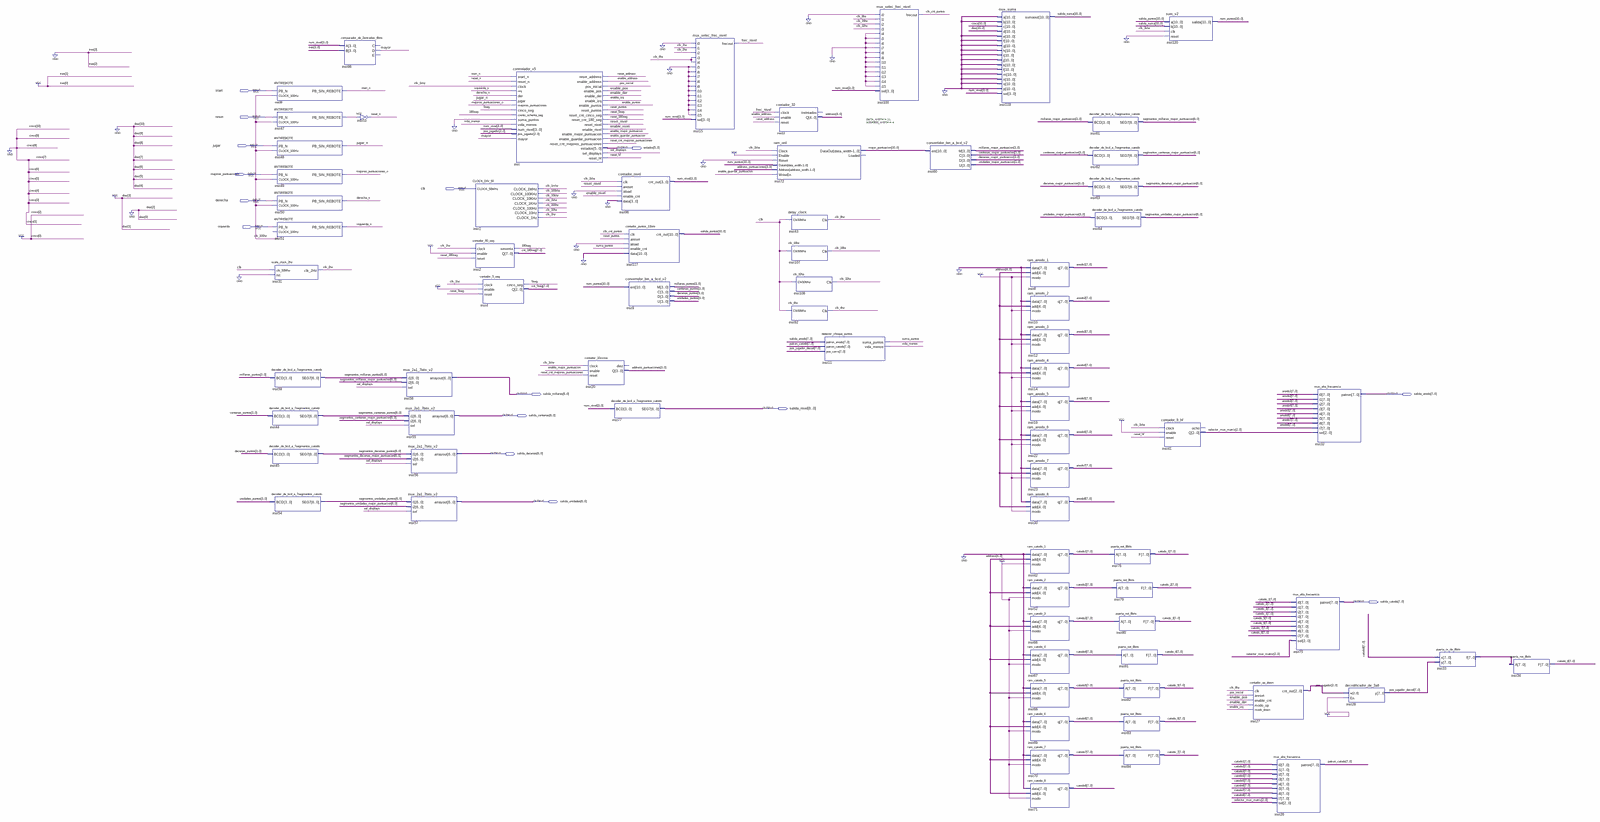
[diagram p0: schematic sheet, whole]
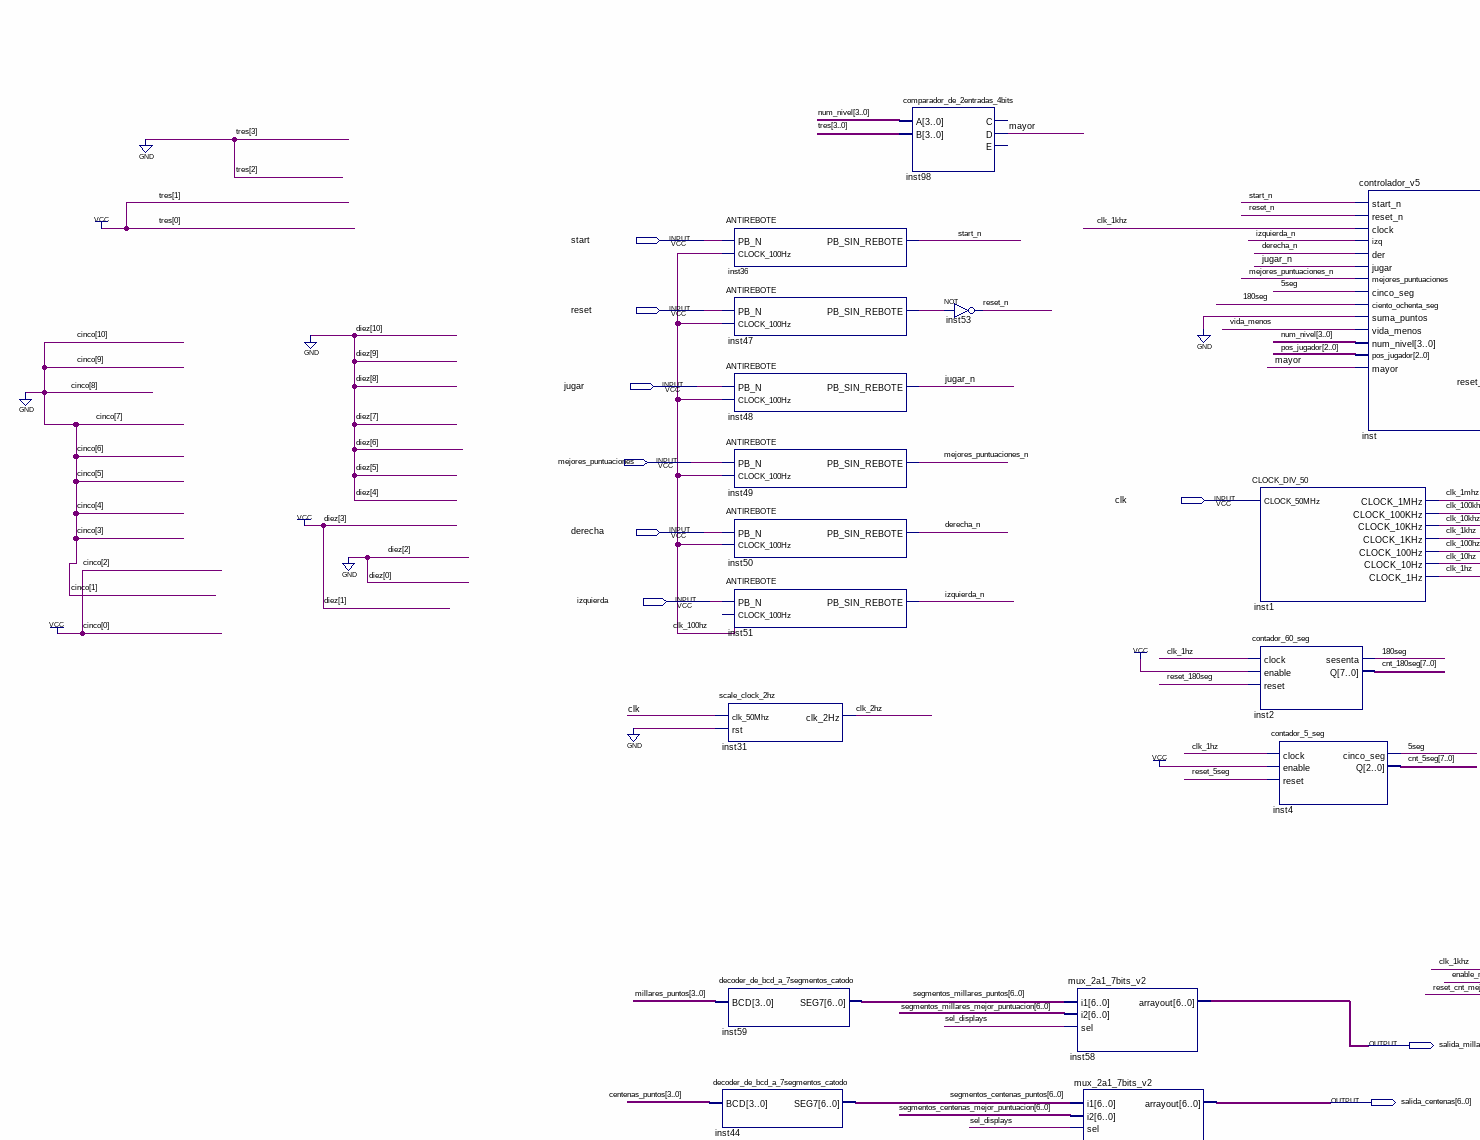
[diagram p1: schematic sheet, upper left part]
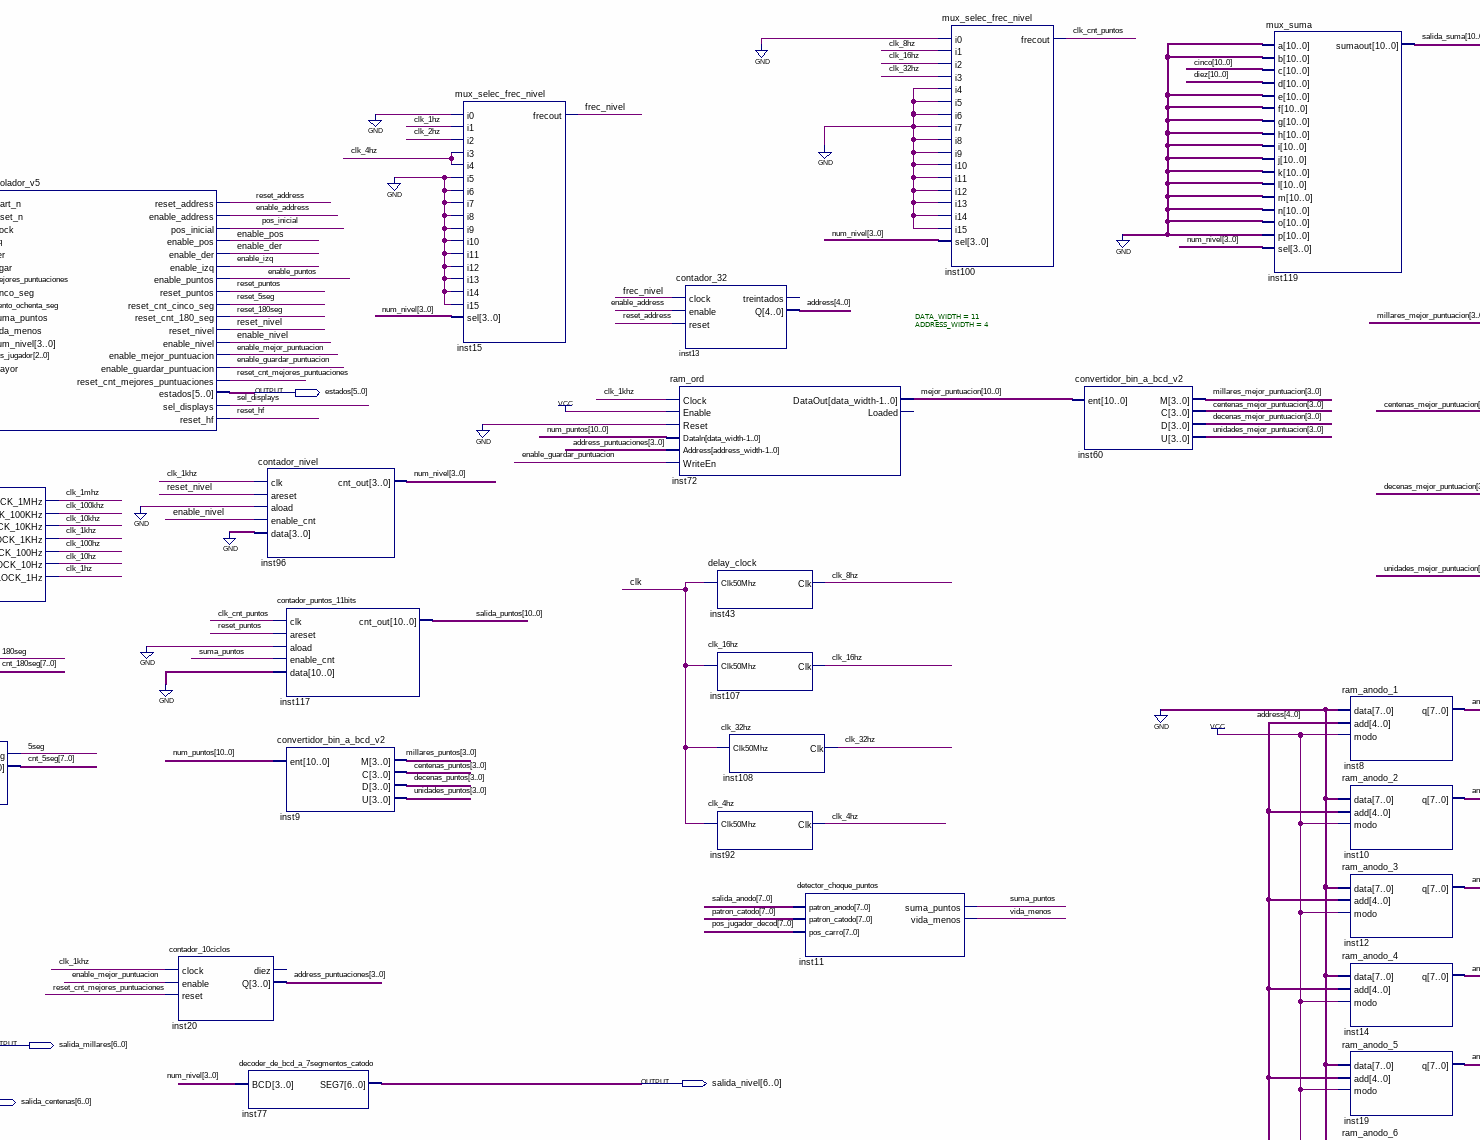
[diagram p2: schematic sheet, upper centre part]
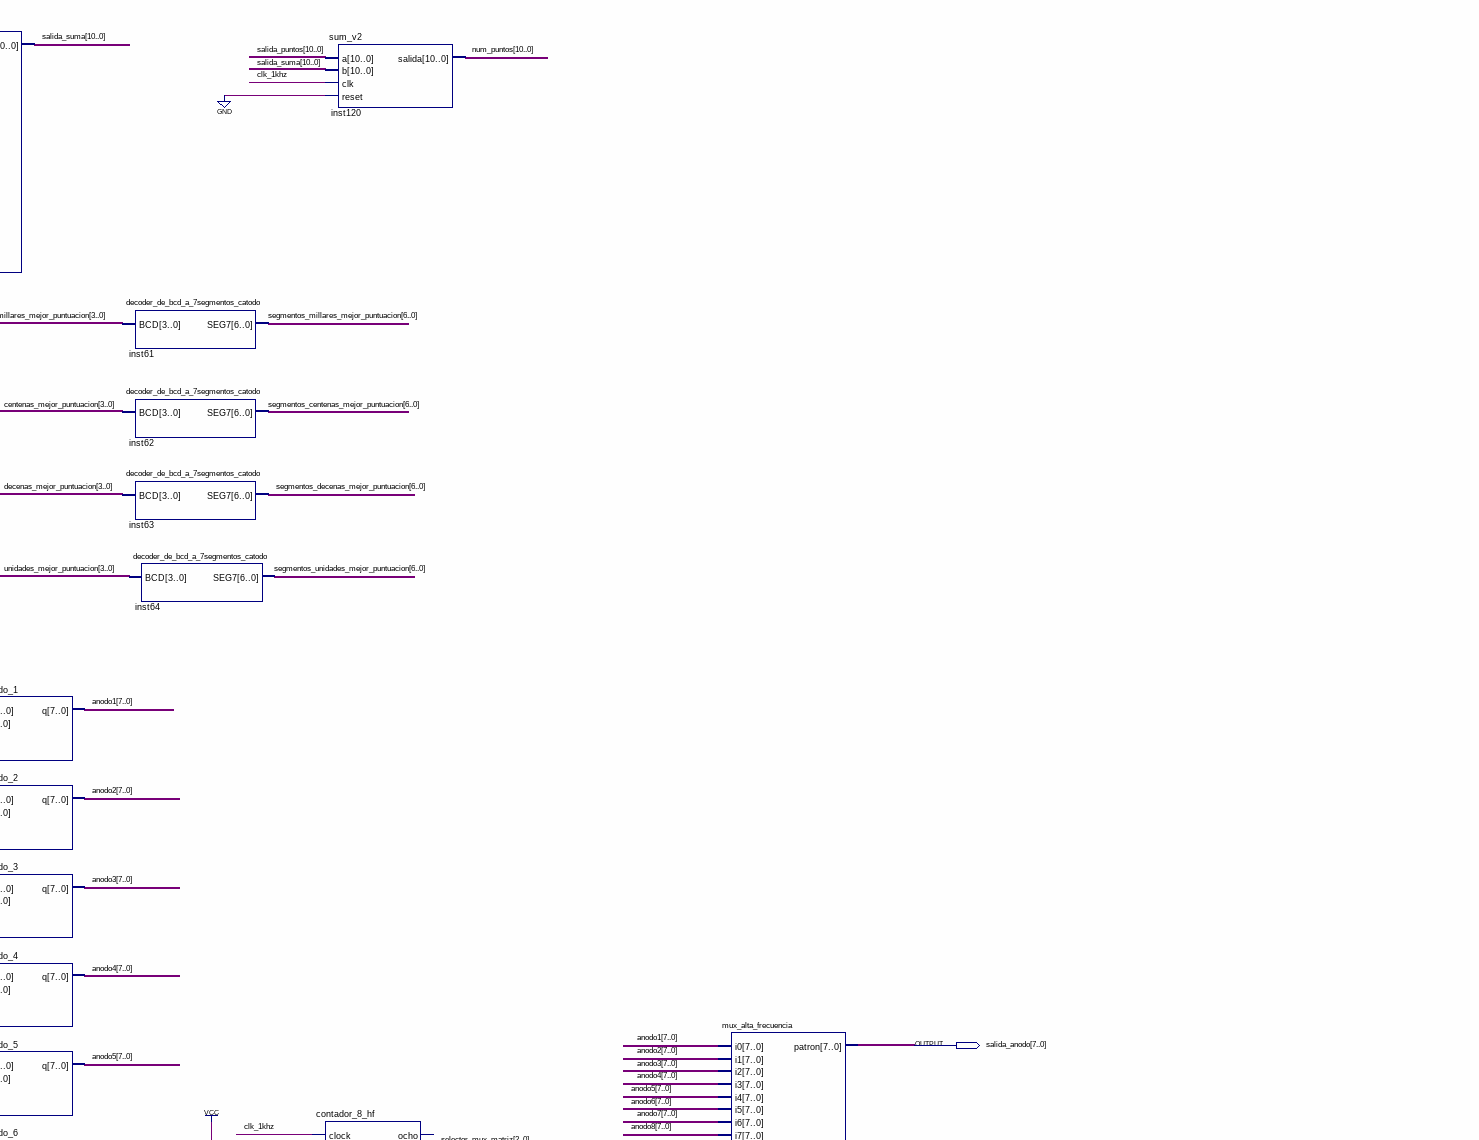
[diagram p3: schematic sheet, upper right part]
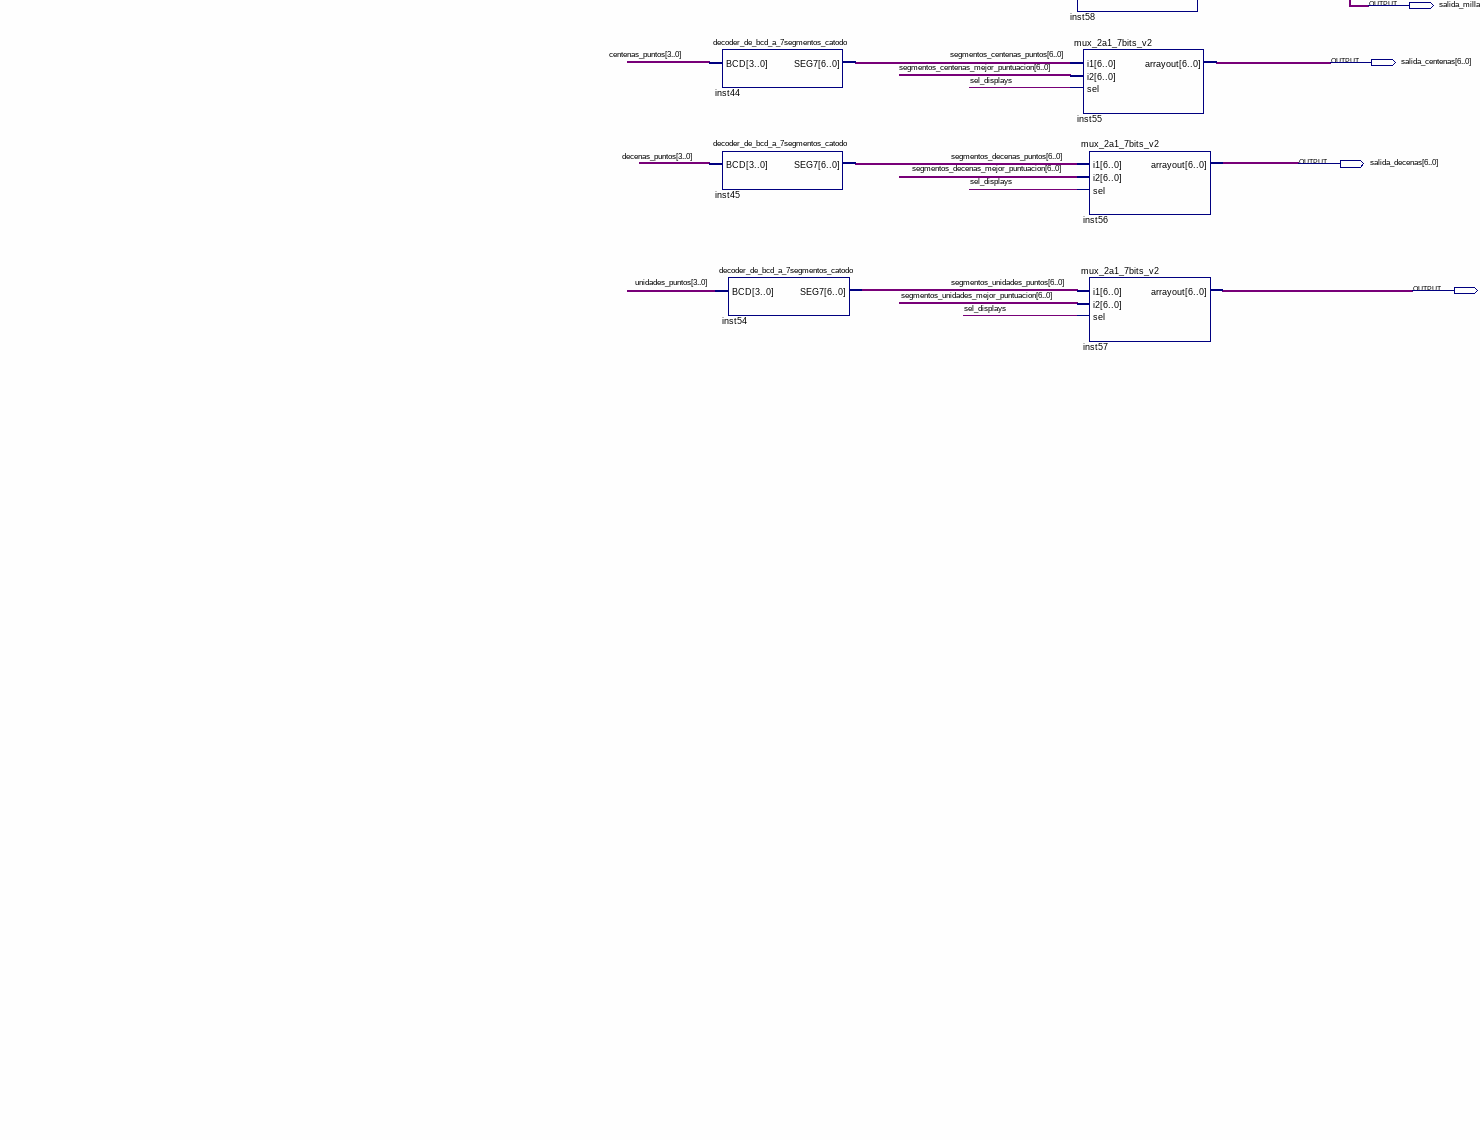
[diagram p4: schematic sheet, lower left part]
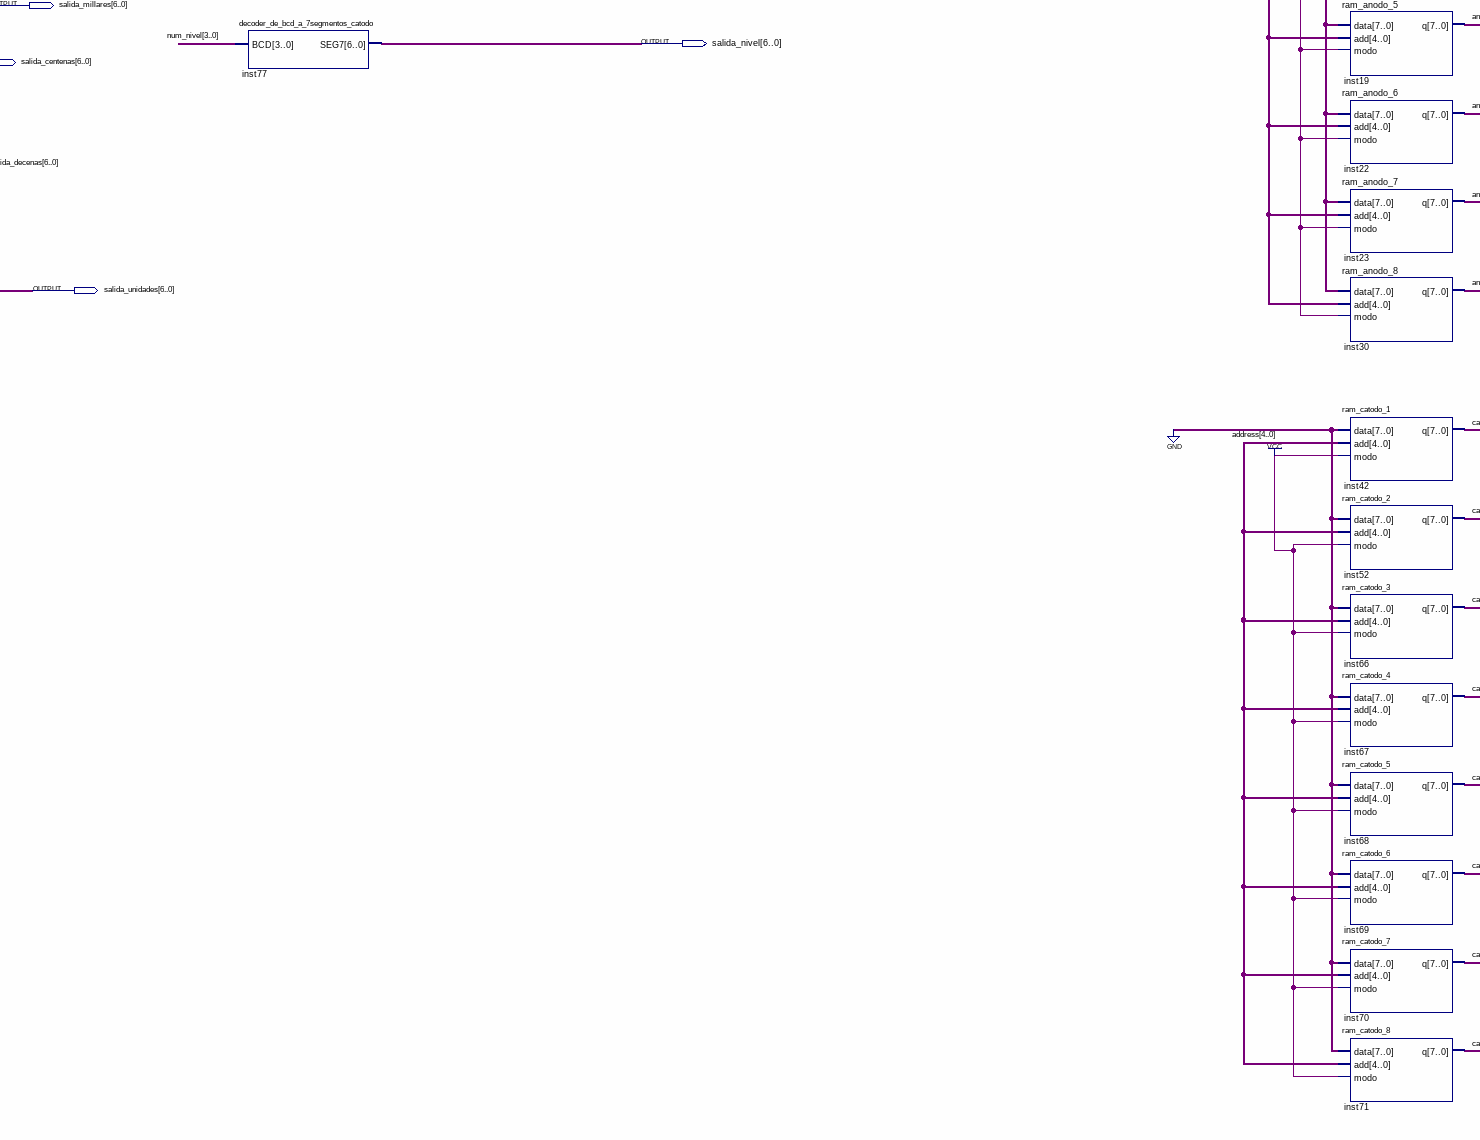
[diagram p5: schematic sheet, lower centre part]
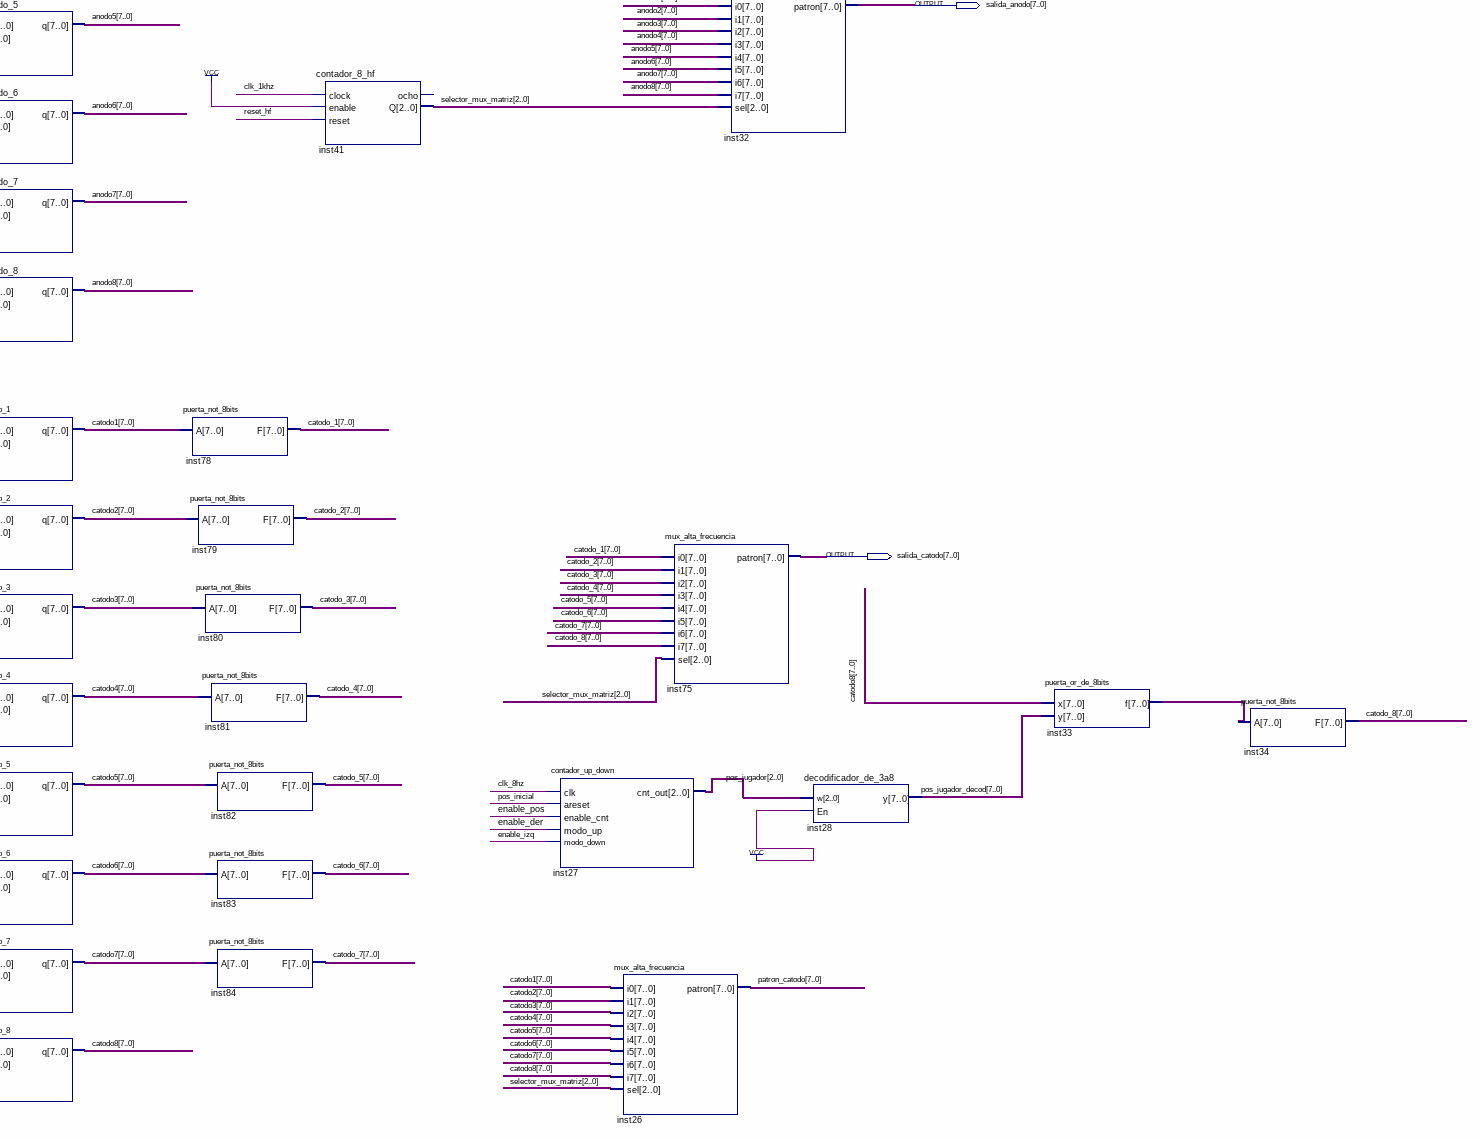
[diagram p6: schematic sheet, lower right part]
// Quartus schematic projectsd2.bdf as structural Verilog: 73 symbols, 15 pins
module projectsd2 (
  input  start,
  input  reset,
  input  jugar,
  input  mejores_puntuaciones,
  input  clk,
  input  derecha,
  input  izquierda,
  output [5:0] estados,
  output [6:0] salida_millares,
  output [7:0] salida_anodo,
  output [6:0] salida_nivel,
  output [6:0] salida_centenas,
  output [6:0] salida_decenas,
  output [6:0] salida_unidades,
  output [7:0] salida_catodo
);

  wire \5seg , \180seg , clk_1hz, clk_1khz, clk_1mhz, clk_2hz, clk_4hz, clk_8hz, clk_10hz, clk_10khz,
       clk_16hz, clk_32hz, clk_100hz, clk_100khz, clk_cnt_puntos, derecha_n, enable_address, enable_der,
       enable_guardar_puntuacion, enable_izq, enable_mejor_puntuacion, enable_nivel, enable_pos,
       enable_puntos, frec_nivel, inst47_pb_sin_rebote, izquierda_n, jugar_n, mayor, mejores_puntuaciones_n,
       pos_inicial, reset_5seg, reset_180seg, reset_address, reset_cnt_mejores_puntuaciones, reset_hf,
       reset_n, reset_nivel, reset_puntos, sel_displays, start_n, suma_puntos, vida_menos;
  wire [2:0] pos_jugador, selector_mux_matriz;
  wire [3:0] address_puntuaciones, centenas_mejor_puntuacion, centenas_puntos, decenas_mejor_puntuacion,
       decenas_puntos, millares_mejor_puntuacion, millares_puntos, num_nivel, unidades_mejor_puntuacion,
       unidades_puntos;
  wire [4:0] address;
  wire [6:0] segmentos_centenas_mejor_puntuacion, segmentos_centenas_puntos,
       segmentos_decenas_mejor_puntuacion, segmentos_decenas_puntos, segmentos_millares_mejor_puntuacion,
       segmentos_millares_puntos, segmentos_unidades_mejor_puntuacion, segmentos_unidades_puntos;
  wire [7:0] anodo1, anodo2, anodo3, anodo4, anodo5, anodo6, anodo7, anodo8, catodo1, catodo2, catodo3,
       catodo4, catodo5, catodo6, catodo7, catodo8, catodo_1, catodo_2, catodo_3, catodo_4, catodo_5,
       catodo_6, catodo_7, catodo_8, cnt_5seg, cnt_180seg, inst33_f, patron_catodo, pos_jugador_decod;
  wire [10:0] mejor_puntuacion, num_puntos, salida_puntos, salida_suma;

  decoder_de_bcd_a_7segmentos_catodo inst44 (.BCD(centenas_puntos), .SEG7(segmentos_centenas_puntos));
  decoder_de_bcd_a_7segmentos_catodo inst45 (.BCD(decenas_puntos), .SEG7(segmentos_decenas_puntos));
  ANTIREBOTE inst36 (.PB_N(start), .CLOCK_100Hz(clk_100hz), .PB_SIN_REBOTE(start_n));
  ANTIREBOTE inst47 (.PB_N(reset), .CLOCK_100Hz(clk_100hz), .PB_SIN_REBOTE(inst47_pb_sin_rebote));
  ANTIREBOTE inst48 (.PB_N(jugar), .CLOCK_100Hz(clk_100hz), .PB_SIN_REBOTE(jugar_n));
  ANTIREBOTE inst49 (.PB_N(mejores_puntuaciones), .CLOCK_100Hz(clk_100hz), .PB_SIN_REBOTE(mejores_puntuaciones_n));
  ANTIREBOTE inst50 (.PB_N(derecha), .CLOCK_100Hz(clk_100hz), .PB_SIN_REBOTE(derecha_n));
  ANTIREBOTE inst51 (.PB_N(izquierda), .CLOCK_100Hz(clk_100hz), .PB_SIN_REBOTE(izquierda_n));
  scale_clock_2hz inst31 (.clk_50Mhz(clk), .rst(1'b0), .clk_2Hz(clk_2hz));
  decoder_de_bcd_a_7segmentos_catodo inst59 (.BCD(millares_puntos), .SEG7(segmentos_millares_puntos));
  decoder_de_bcd_a_7segmentos_catodo inst54 (.BCD(unidades_puntos), .SEG7(segmentos_unidades_puntos));
  comparador_de_2entradas_4bits inst98 (.A(num_nivel), .B(4'b0011), .D(mayor));  // open: C, E
  not inst53 (reset_n, inst47_pb_sin_rebote);
  mux_2a1_7bits_v2 inst58 (
    .i1(segmentos_millares_puntos), .i2(segmentos_millares_mejor_puntuacion), .sel(sel_displays),
    .arrayout(salida_millares));
  mux_2a1_7bits_v2 inst55 (
    .i1(segmentos_centenas_puntos), .i2(segmentos_centenas_mejor_puntuacion), .sel(sel_displays),
    .arrayout(salida_centenas));
  mux_2a1_7bits_v2 inst56 (
    .i1(segmentos_decenas_puntos), .i2(segmentos_decenas_mejor_puntuacion), .sel(sel_displays),
    .arrayout(salida_decenas));
  mux_2a1_7bits_v2 inst57 (
    .i1(segmentos_unidades_puntos), .i2(segmentos_unidades_mejor_puntuacion), .sel(sel_displays),
    .arrayout(salida_unidades));
  CLOCK_DIV_50 inst1 (
    .CLOCK_50MHz(clk), .CLOCK_1MHz(clk_1mhz), .CLOCK_100KHz(clk_100khz), .CLOCK_10KHz(clk_10khz),
    .CLOCK_1KHz(clk_1khz), .CLOCK_100Hz(clk_100hz), .CLOCK_10Hz(clk_10hz), .CLOCK_1Hz(clk_1hz));
  contador_60_seg inst2 (.clock(clk_1hz), .enable(1'b1), .reset(reset_180seg), .sesenta(\180seg ), .Q(cnt_180seg));
  contador_5_seg inst4 (.clock(clk_1hz), .enable(1'b1), .reset(reset_5seg), .cinco_seg(\5seg ), .Q(cnt_5seg));
  controlador_v5 inst (
    .start_n(start_n), .reset_n(reset_n), .clock(clk_1khz), .izq(izquierda_n), .der(derecha_n),
    .jugar(jugar_n), .mejores_puntuaciones(mejores_puntuaciones_n), .cinco_seg(\5seg ),
    .ciento_ochenta_seg(\180seg ), .suma_puntos(1'b0), .vida_menos(vida_menos), .num_nivel(num_nivel),
    .pos_jugador(pos_jugador), .mayor(mayor), .reset_address(reset_address), .enable_address(enable_address),
    .pos_inicial(pos_inicial), .enable_pos(enable_pos), .enable_der(enable_der), .enable_izq(enable_izq),
    .enable_puntos(enable_puntos), .reset_puntos(reset_puntos), .reset_cnt_cinco_seg(reset_5seg),
    .reset_cnt_180_seg(reset_180seg), .reset_nivel(reset_nivel), .enable_nivel(enable_nivel),
    .enable_mejor_puntuacion(enable_mejor_puntuacion), .enable_guardar_puntuacion(enable_guardar_puntuacion),
    .reset_cnt_mejores_puntuaciones(reset_cnt_mejores_puntuaciones), .estados(estados),
    .sel_displays(sel_displays), .reset_hf(reset_hf));
  contador_10ciclos inst20 (
    .clock(clk_1khz), .enable(enable_mejor_puntuacion), .reset(reset_cnt_mejores_puntuaciones),
    .Q(address_puntuaciones));  // open: diez
  decoder_de_bcd_a_7segmentos_catodo inst77 (.BCD(num_nivel), .SEG7(salida_nivel));
  contador_nivel inst96 (
    .clk(clk_1khz), .areset(reset_nivel), .aload(1'b0), .enable_cnt(enable_nivel), .data(4'b0000),
    .cnt_out(num_nivel));
  contador_puntos_11bits inst117 (
    .clk(clk_cnt_puntos), .areset(reset_puntos), .aload(1'b0), .enable_cnt(suma_puntos), .data({11{1'b0}}),
    .cnt_out(salida_puntos));
  convertidor_bin_a_bcd_v2 inst9 (
    .ent(num_puntos), .M(millares_puntos), .C(centenas_puntos), .D(decenas_puntos), .U(unidades_puntos));
  mux_selec_frec_nivel inst15 (
    .i0(1'b0), .i1(clk_1hz), .i2(clk_2hz), .i3(clk_4hz), .i4(clk_4hz), .i5(1'b0), .i6(1'b0), .i7(1'b0),
    .i8(1'b0), .i9(1'b0), .i10(1'b0), .i11(1'b0), .i12(1'b0), .i13(1'b0), .i14(1'b0), .i15(1'b0),
    .sel(num_nivel), .frecout(frec_nivel));
  contador_32 inst13 (
    .clock(frec_nivel), .enable(enable_address), .reset(reset_address), .Q(address));  // open: treintados
  ram_ord #(.DATA_WIDTH(11), .ADDRESS_WIDTH(4)) inst72 (
    .Clock(clk_1khz), .Enable(1'b1), .Reset(1'b0), .DataIn(num_puntos), .Address(address_puntuaciones),
    .WriteEn(enable_guardar_puntuacion), .DataOut(mejor_puntuacion));  // open: Loaded
  delay_clock inst43 (.Clk50Mhz(clk), .Clk(clk_8hz));
  clk_16hz inst107 (.Clk50Mhz(clk), .Clk(clk_16hz));
  clk_32hz inst108 (.Clk50Mhz(clk), .Clk(clk_32hz));
  clk_4hz inst92 (.Clk50Mhz(clk), .Clk(clk_4hz));
  detector_choque_puntos inst11 (
    .patron_anodo(salida_anodo), .patron_catodo(patron_catodo), .pos_carro(pos_jugador_decod),
    .suma_puntos(suma_puntos), .vida_menos(vida_menos));
  mux_selec_frec_nivel inst100 (
    .i0(1'b0), .i1(clk_8hz), .i2(clk_16hz), .i3(clk_32hz), .i4(1'b0), .i5(1'b0), .i6(1'b0), .i7(1'b0),
    .i8(1'b0), .i9(1'b0), .i10(1'b0), .i11(1'b0), .i12(1'b0), .i13(1'b0), .i14(1'b0), .i15(1'b0),
    .sel(num_nivel), .frecout(clk_cnt_puntos));
  convertidor_bin_a_bcd_v2 inst60 (
    .ent(mejor_puntuacion), .M(millares_mejor_puntuacion), .C(centenas_mejor_puntuacion),
    .D(decenas_mejor_puntuacion), .U(unidades_mejor_puntuacion));
  mux_suma inst119 (
    .a({11{1'b0}}), .b({11{1'b0}}), .c(11'b00000000101), .d(11'b00000001010), .e({11{1'b0}}), .f({11{1'b0}}),
    .g({11{1'b0}}), .h({11{1'b0}}), .i({11{1'b0}}), .j({11{1'b0}}), .k({11{1'b0}}), .l({11{1'b0}}),
    .m({11{1'b0}}), .n({11{1'b0}}), .o({11{1'b0}}), .p({11{1'b0}}), .sel(num_nivel), .sumaout(salida_suma));
  ram_anodo_1 inst8 (.data({8{1'b0}}), .add(address), .modo(1'b1), .q(anodo1));
  ram_anodo_2 inst10 (.data({8{1'b0}}), .add(address), .modo(1'b1), .q(anodo2));
  ram_anodo_3 inst12 (.data({8{1'b0}}), .add(address), .modo(1'b1), .q(anodo3));
  ram_anodo_4 inst14 (.data({8{1'b0}}), .add(address), .modo(1'b1), .q(anodo4));
  ram_anodo_5 inst19 (.data({8{1'b0}}), .add(address), .modo(1'b1), .q(anodo5));
  ram_anodo_6 inst22 (.data({8{1'b0}}), .add(address), .modo(1'b1), .q(anodo6));
  ram_anodo_7 inst23 (.data({8{1'b0}}), .add(address), .modo(1'b1), .q(anodo7));
  ram_anodo_8 inst30 (.data({8{1'b0}}), .add(address), .modo(1'b1), .q(anodo8));
  ram_catodo_1 inst42 (.data({8{1'b0}}), .add(address), .modo(1'b1), .q(catodo1));
  ram_catodo_2 inst52 (.data({8{1'b0}}), .add(address), .modo(1'b1), .q(catodo2));
  ram_catodo_3 inst66 (.data({8{1'b0}}), .add(address), .modo(1'b1), .q(catodo3));
  ram_catodo_4 inst67 (.data({8{1'b0}}), .add(address), .modo(1'b1), .q(catodo4));
  ram_catodo_5 inst68 (.data({8{1'b0}}), .add(address), .modo(1'b1), .q(catodo5));
  ram_catodo_6 inst69 (.data({8{1'b0}}), .add(address), .modo(1'b1), .q(catodo6));
  ram_catodo_7 inst70 (.data({8{1'b0}}), .add(address), .modo(1'b1), .q(catodo7));
  ram_catodo_8 inst71 (.data({8{1'b0}}), .add(address), .modo(1'b1), .q(catodo8));
  decoder_de_bcd_a_7segmentos_catodo inst61 (
    .BCD(millares_mejor_puntuacion), .SEG7(segmentos_millares_mejor_puntuacion));
  decoder_de_bcd_a_7segmentos_catodo inst62 (
    .BCD(centenas_mejor_puntuacion), .SEG7(segmentos_centenas_mejor_puntuacion));
  decoder_de_bcd_a_7segmentos_catodo inst63 (.BCD(decenas_mejor_puntuacion), .SEG7(segmentos_decenas_mejor_puntuacion));
  decoder_de_bcd_a_7segmentos_catodo inst64 (
    .BCD(unidades_mejor_puntuacion), .SEG7(segmentos_unidades_mejor_puntuacion));
  puerta_not_8bits inst78 (.A(catodo1), .F(catodo_1));
  puerta_not_8bits inst79 (.A(catodo2), .F(catodo_2));
  puerta_not_8bits inst80 (.A(catodo3), .F(catodo_3));
  puerta_not_8bits inst81 (.A(catodo4), .F(catodo_4));
  puerta_not_8bits inst82 (.A(catodo5), .F(catodo_5));
  puerta_not_8bits inst83 (.A(catodo6), .F(catodo_6));
  puerta_not_8bits inst84 (.A(catodo7), .F(catodo_7));
  sum_v2 inst120 (.a(salida_puntos), .b(salida_suma), .clk(clk_1khz), .reset(1'b0), .salida(num_puntos));
  contador_8_hf inst41 (.clock(clk_1khz), .enable(1'b1), .reset(reset_hf), .Q(selector_mux_matriz));  // open: ocho
  contador_up_down inst27 (
    .clk(clk_8hz), .areset(pos_inicial), .enable_cnt(enable_pos), .modo_up(enable_der),
    .modo_down(enable_izq), .cnt_out(pos_jugador));
  mux_alta_frecuencia inst26 (
    .i0(catodo1), .i1(catodo2), .i2(catodo3), .i3(catodo4), .i4(catodo5), .i5(catodo6), .i6(catodo7),
    .i7(catodo8), .sel(selector_mux_matriz), .patron(patron_catodo));
  mux_alta_frecuencia inst75 (
    .i0(catodo_1), .i1(catodo_2), .i2(catodo_3), .i3(catodo_4), .i4(catodo_5), .i5(catodo_6), .i6(catodo_7),
    .i7(catodo_8), .sel(selector_mux_matriz), .patron(salida_catodo));
  mux_alta_frecuencia inst32 (
    .i0(anodo1), .i1(anodo2), .i2(anodo3), .i3(anodo4), .i4(anodo5), .i5(anodo6), .i6(anodo7), .i7(anodo8),
    .sel(selector_mux_matriz), .patron(salida_anodo));
  decodificador_de_3a8 inst28 (.w(pos_jugador), .En(1'b1), .y(pos_jugador_decod));
  puerta_or_de_8bits inst33 (.x(catodo8), .y(pos_jugador_decod), .f(inst33_f));
  puerta_not_8bits inst34 (.A(inst33_f), .F(catodo_8));
endmodule
